# Altium schematic sheet 1U 显示.SchDoc
size A1
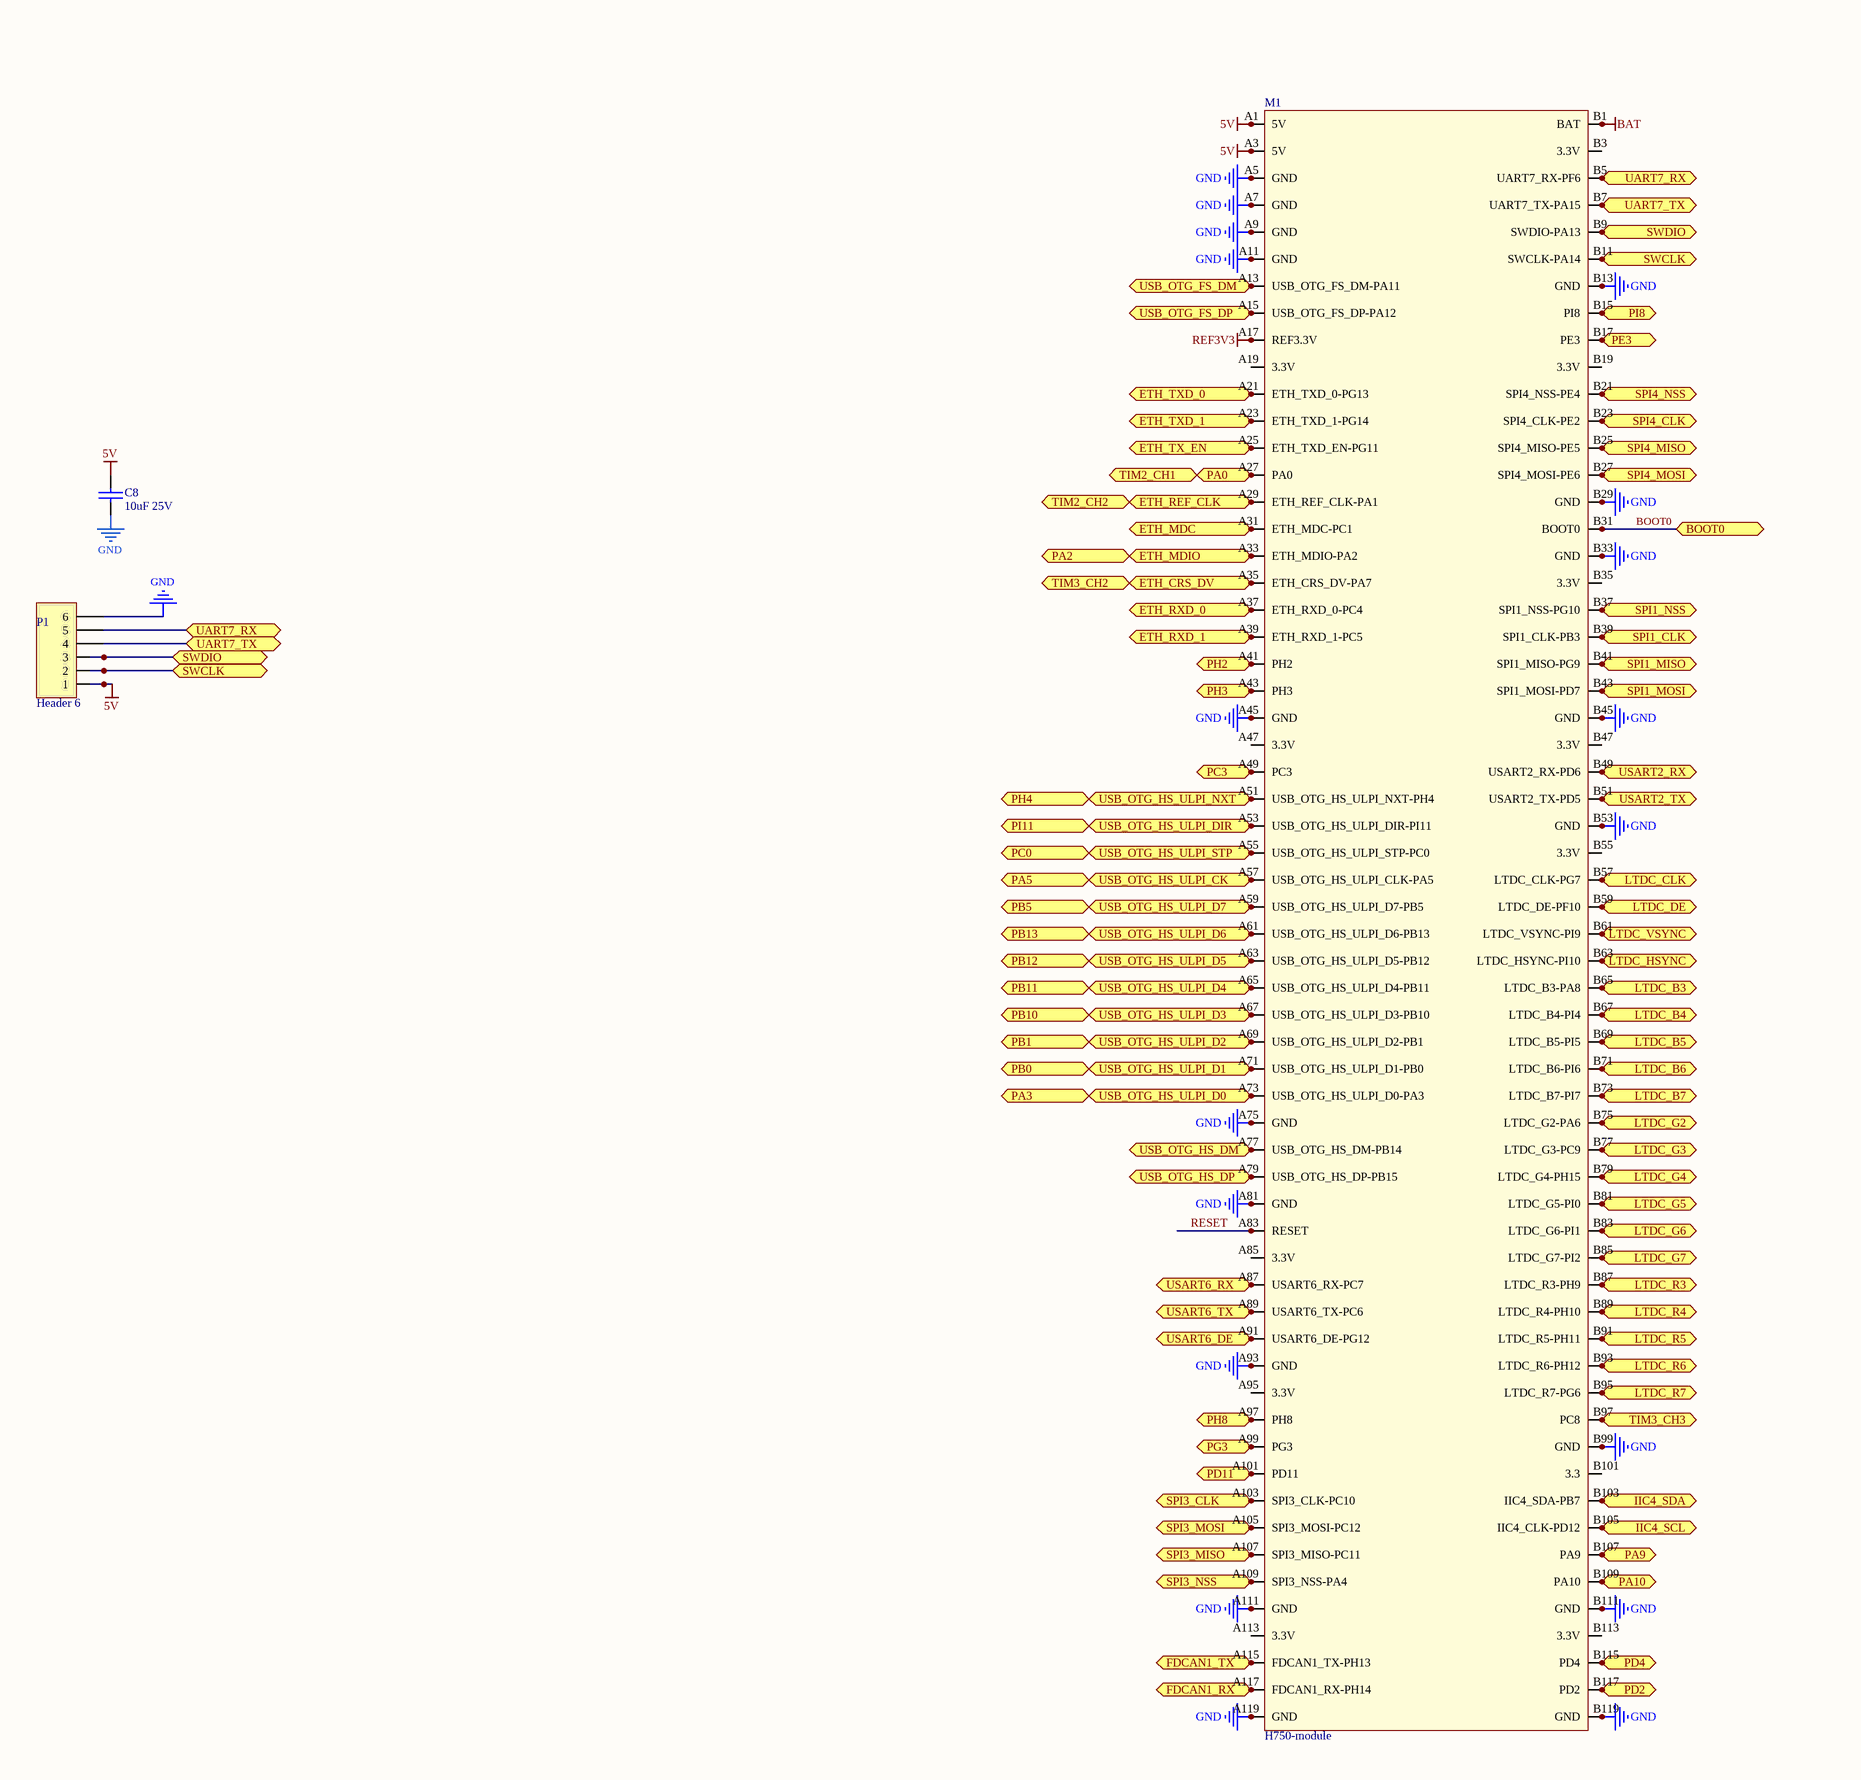
[diagram p0: 1U 显示.SchDoc, left]
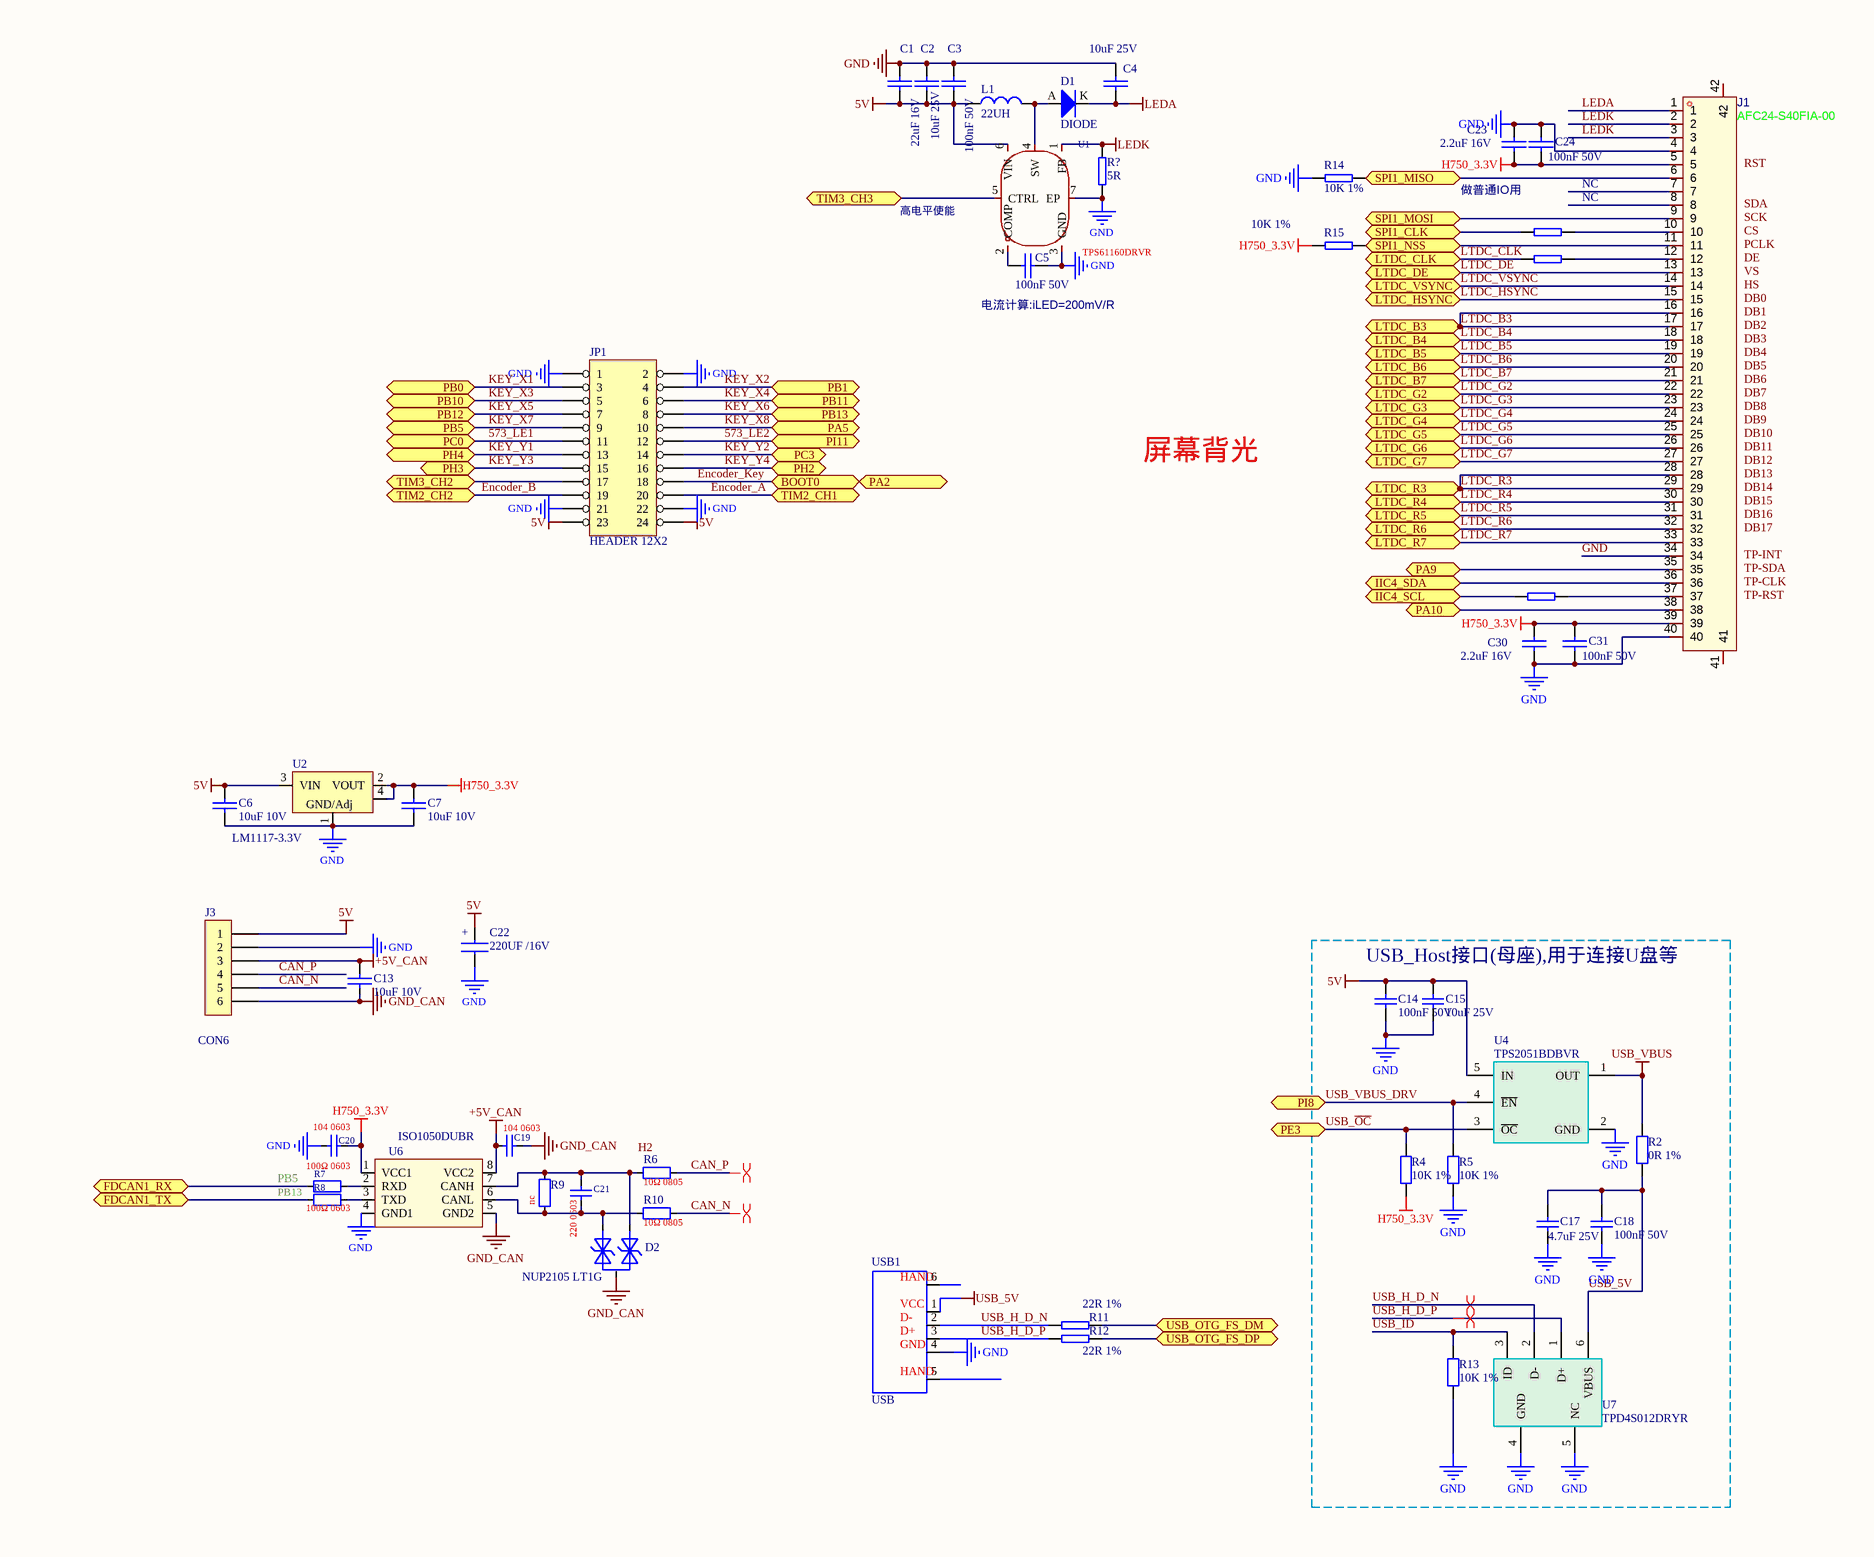
[diagram p1: 1U 显示.SchDoc, right]

## Parts
C1  22uF 16V  [C0805-M]
C2  10uF 25V  [C0805-M]
C3  100nF 50V  [C0805-M]
C4  10uF 25V  [C0805-M]
C5  100nF 50V  [C0603]
C6  10uF 10V  [C0603]
C7  10uF 10V  [C0603]
C8  10uF 25V  [C0805]
C13  10uF 10V  [C0603]
C14  100nF 50V  [C0603]
C15  10uF 25V  [C0805]
C17  4.7uF 25V  [C0603]
C18  100nF 50V  [C0603]
C19  104 0603  [C0603]
C20  104 0603  [C0603]
C21  220 0603  [C0603]
C22  220UF /16V  [RB-.63]
C23  2.2uF 16V  [C0603]
C24  100nF 50V  [C0603]
C30  2.2uF 16V  [C0603]
C31  100nF 50V  [C0603]
D1  DIODE  [SOD-123]
D2  NUP2105 LT1G  [SOT-23]
J1  AFC24-S40FIA-00  [FPC-SMD_P0.50-40P_H2.0]
J3  CON6  [xh-6a]
JP1  HEADER 12X2  [FPC-SMD_P0.50-24P_H2.0]
L1  22UH  [L0520]
M1  H750-module  [H750-module]
P1  Header 6  [HDR1X6]
R2  0R 1%  [R0603]
R4  10K 1%  [R0603]
R5  10K 1%  [R0603]
R6  10Ω 0805  [R0805-M]
R7  100Ω 0603  [R0603]
R8  100Ω 0603  [R0603]
R9  nc  [R0805-M]
R10  10Ω 0805  [R0805-M]
R11  22R 1%  [R0603]
R12  22R 1%  [R0603]
R13  10K 1%  [R0603]
R14  10K 1%  [R0603]
R15  10K 1%  [R0603]
R16  22R 1%  [R0603]  (value not drawn)
R17  22R 1%  [R0603]  (value not drawn)
R18  22R 1%  [R0603]  (value not drawn)
R?  5R  [R0805-M]
U1  TPS61160DRVR  [WSON-6-EP(2x2)]
U2  LM1117-3.3V  [SOT-223]
U4  TPS2051BDBVR  [SOT-23-5]
U6  ISO1050DUBR  [DIP-8/STM]
U7  TPD4S012DRYR  [DRY-6]
USB1  USB  [USB-101]

## Blocks framed on the sheet
USB_Host接口(母座),用于连接U盘等: C14 C15 C17 C18 R2 R4 R5 R13 U4 U7

## Ports
BOOT0 (bidir), ETH_CRS_DV (bidir), ETH_MDC (bidir), ETH_MDIO (bidir), ETH_REF_CLK (bidir), ETH_RXD_0 (bidir), ETH_RXD_1 (bidir), ETH_TX_EN (bidir), ETH_TXD_0 (bidir), ETH_TXD_1 (bidir), FDCAN1_RX (bidir), FDCAN1_TX (bidir), IIC4_SCL (bidir), IIC4_SDA (bidir), LTDC_B3 (bidir), LTDC_B4 (bidir), LTDC_B5 (bidir), LTDC_B6 (bidir), LTDC_B7 (bidir), LTDC_CLK (bidir), LTDC_DE (bidir), LTDC_G2 (bidir), LTDC_G3 (bidir), LTDC_G4 (bidir), LTDC_G5 (bidir), LTDC_G6 (bidir), LTDC_G7 (bidir), LTDC_HSYNC (bidir), LTDC_R3 (bidir), LTDC_R4 (bidir), LTDC_R5 (bidir), LTDC_R6 (bidir), LTDC_R7 (bidir), LTDC_VSYNC (bidir), PA0 (bidir), PA2 (bidir), PA3 (bidir), PA5 (bidir), PA9 (bidir), PA10 (bidir), PB0 (bidir), PB1 (bidir), PB5 (bidir), PB10 (bidir), PB11 (bidir), PB12 (bidir), PB13 (bidir), PC0 (bidir), PC3 (bidir), PD2 (bidir), PD4 (bidir), PD11 (bidir), PE3 (bidir), PG3 (bidir), PH2 (bidir), PH3 (bidir), PH4 (bidir), PH8 (bidir), PI8 (bidir), PI11 (bidir), SPI1_CLK (bidir), SPI1_MISO (bidir), SPI1_MOSI (bidir), SPI1_NSS (bidir), SPI3_CLK (bidir), SPI3_MISO (bidir), SPI3_MOSI (bidir), SPI3_NSS (bidir), SPI4_CLK (bidir), SPI4_MISO (bidir), SPI4_MOSI (bidir), SPI4_NSS (bidir), SWCLK (bidir), SWDIO (bidir), TIM2_CH1 (bidir), TIM2_CH2 (bidir), TIM3_CH2 (bidir), TIM3_CH3 (bidir), UART7_RX (bidir), UART7_TX (bidir), USART2_RX (bidir), USART2_TX (bidir), USART6_DE (bidir), USART6_RX (bidir), USART6_TX (bidir), USB_OTG_FS_DM (bidir), USB_OTG_FS_DP (bidir), USB_OTG_HS_DM (bidir), USB_OTG_HS_DP (bidir), USB_OTG_HS_ULPI_CK (bidir), USB_OTG_HS_ULPI_D0 (bidir), USB_OTG_HS_ULPI_D1 (bidir), USB_OTG_HS_ULPI_D2 (bidir), USB_OTG_HS_ULPI_D3 (bidir), USB_OTG_HS_ULPI_D4 (bidir), USB_OTG_HS_ULPI_D5 (bidir), USB_OTG_HS_ULPI_D6 (bidir), USB_OTG_HS_ULPI_D7 (bidir), USB_OTG_HS_ULPI_DIR (bidir), USB_OTG_HS_ULPI_NXT (bidir), USB_OTG_HS_ULPI_STP (bidir)

## Nets
5V: C1.1 C2.1 C3.1 C6.1 C8.1 C14.2 C15.2 C22.1 J3.1 JP1.23 JP1.24 L1.1 M1.A1(5V) M1.A2 M1.A3(5V) M1.A4 P1.1 U1.6(VIN) U2.3(VIN) U4.5(IN)
+5V_CAN: C13.1 C19.1 J3.3 U6.8(VCC2)
BAT: M1.B1(BAT) M1.B2
GND: C1.2 C2.2 C3.2 C4.2 C5.2 C6.2 C7.2 C8.2 C14.1 C15.1 C17.1 C18.1 C20.1 C22.2 C23.2 C24.1 C30.1 C31.2 J1.4 J1.34 J1.40 J3.2 JP1.1 JP1.2 JP1.21 JP1.22 M1.A5(GND) M1.A6 M1.A7(GND) M1.A8 M1.A9(GND) M1.A10 M1.A11(GND) M1.A12 M1.A45(GND) M1.A46 M1.A75(GND) M1.A76 M1.A81(GND) M1.A82 M1.A93(GND) M1.A94 M1.A111(GND) M1.A112 M1.A119(GND) M1.A120 M1.B13(GND) M1.B14 M1.B29(GND) M1.B30 M1.B33(GND) M1.B34 M1.B45(GND) M1.B46 M1.B53(GND) M1.B54 M1.B99(GND) M1.B100 M1.B111(GND) M1.B112 M1.B119(GND) M1.B120 P1.6 R5.2 R13.2 R14.1 R?.1 U1.3(GND) U1.7(EP) U2.1(GND/Adj) U4.2(GND) U6.4(GND1) U7.4(GND) U7.5(NC) USB1.4
GND_CAN: C13.2 C19.2 D2.3 J3.6 U6.5(GND2)
H750_3.3V: C7.1 C20.2 C23.1 C24.2 C30.2 C31.1 J1.5 J1.39 R4.2 R15.1 U2.2(VOUT) U2.4 U6.1(VCC1)
LEDA: C4.1 D1.K J1.1
LEDK: J1.2 J1.3 R?.2 U1.1(FB)
REF3V3: M1.A17(REF3.3V) M1.A18
USB_5V: C17.2 C18.2 R2.2 U7.6(VBUS) USB1.1
USB_VBUS: R2.1 U4.1(OUT)
573_LE1: JP1.11 M1.A55(USB_OTG_HS_ULPI_STP-PC0) M1.A56 ; port USB_OTG_HS_ULPI_STP, port PC0
573_LE2: JP1.12 M1.A53(USB_OTG_HS_ULPI_DIR-PI11) M1.A54 ; port USB_OTG_HS_ULPI_DIR, port PI11
BOOT0: JP1.18 M1.A33(ETH_MDIO-PA2) M1.A34 M1.B31(BOOT0) M1.B32 ; port ETH_MDIO, port PA2, port BOOT0  [also labelled Encoder_Key]
CAN_N: J3.5 R10.2
CAN_P: J3.4 R6.2
Encoder_A: JP1.20 M1.A27(PA0) M1.A28 ; port PA0, port TIM2_CH1
Encoder_B: JP1.19 M1.A29(ETH_REF_CLK-PA1) M1.A30 ; port ETH_REF_CLK, port TIM2_CH2
ETH_CRS_DV: JP1.17 M1.A35(ETH_CRS_DV-PA7) M1.A36 ; port ETH_CRS_DV, port TIM3_CH2
ETH_MDC: M1.A31(ETH_MDC-PC1) M1.A32 ; port ETH_MDC
ETH_RXD_0: M1.A37(ETH_RXD_0-PC4) M1.A38 ; port ETH_RXD_0
ETH_RXD_1: M1.A39(ETH_RXD_1-PC5) M1.A40 ; port ETH_RXD_1
ETH_TX_EN: M1.A25(ETH_TXD_EN-PG11) M1.A26 ; port ETH_TX_EN
ETH_TXD_0: M1.A21(ETH_TXD_0-PG13) M1.A22 ; port ETH_TXD_0
ETH_TXD_1: M1.A23(ETH_TXD_1-PG14) M1.A24 ; port ETH_TXD_1
IIC4_SCL: M1.B105(IIC4_CLK-PD12) M1.B106 R18.1 ; port IIC4_SCL
IIC4_SDA: J1.36 M1.B103(IIC4_SDA-PB7) M1.B104 ; port IIC4_SDA
KEY_X1: JP1.3 M1.A71(USB_OTG_HS_ULPI_D1-PB0) M1.A72 ; port USB_OTG_HS_ULPI_D1, port PB0
KEY_X2: JP1.4 M1.A69(USB_OTG_HS_ULPI_D2-PB1) M1.A70 ; port USB_OTG_HS_ULPI_D2, port PB1
KEY_X3: JP1.5 M1.A67(USB_OTG_HS_ULPI_D3-PB10) M1.A68 ; port USB_OTG_HS_ULPI_D3, port PB10
KEY_X4: JP1.6 M1.A65(USB_OTG_HS_ULPI_D4-PB11) M1.A66 ; port USB_OTG_HS_ULPI_D4, port PB11
KEY_X5: JP1.7 M1.A63(USB_OTG_HS_ULPI_D5-PB12) M1.A64 ; port USB_OTG_HS_ULPI_D5, port PB12
KEY_X6: JP1.8 M1.A61(USB_OTG_HS_ULPI_D6-PB13) M1.A62 ; port USB_OTG_HS_ULPI_D6, port PB13
KEY_X7: JP1.9 M1.A59(USB_OTG_HS_ULPI_D7-PB5) M1.A60 ; port USB_OTG_HS_ULPI_D7, port PB5
KEY_X8: JP1.10 M1.A57(USB_OTG_HS_ULPI_CLK-PA5) M1.A58 ; port USB_OTG_HS_ULPI_CK, port PA5
KEY_Y1: JP1.13 M1.A51(USB_OTG_HS_ULPI_NXT-PH4) M1.A52 ; port USB_OTG_HS_ULPI_NXT, port PH4
KEY_Y2: JP1.14 M1.A49(PC3) M1.A50 ; port PC3
KEY_Y3: JP1.15 M1.A43(PH3) M1.A44 ; port PH3
KEY_Y4: JP1.16 M1.A41(PH2) M1.A42 ; port PH2
LTDC_B3: J1.16 J1.17 M1.B65(LTDC_B3-PA8) M1.B66 ; port LTDC_B3
LTDC_B4: J1.18 M1.B67(LTDC_B4-PI4) M1.B68 ; port LTDC_B4
LTDC_B5: J1.19 M1.B69(LTDC_B5-PI5) M1.B70 ; port LTDC_B5
LTDC_B6: J1.20 M1.B71(LTDC_B6-PI6) M1.B72 ; port LTDC_B6
LTDC_B7: J1.21 M1.B73(LTDC_B7-PI7) M1.B74 ; port LTDC_B7
LTDC_CLK: M1.B57(LTDC_CLK-PG7) M1.B58 R17.1 ; port LTDC_CLK
LTDC_DE: J1.13 M1.B59(LTDC_DE-PF10) M1.B60 ; port LTDC_DE
LTDC_G2: J1.22 M1.B75(LTDC_G2-PA6) M1.B76 ; port LTDC_G2
LTDC_G3: J1.23 M1.B77(LTDC_G3-PC9) M1.B78 ; port LTDC_G3
LTDC_G4: J1.24 M1.B79(LTDC_G4-PH15) M1.B80 ; port LTDC_G4
LTDC_G5: J1.25 M1.B81(LTDC_G5-PI0) M1.B82 ; port LTDC_G5
LTDC_G6: J1.26 M1.B83(LTDC_G6-PI1) M1.B84 ; port LTDC_G6
LTDC_G7: J1.27 M1.B85(LTDC_G7-PI2) M1.B86 ; port LTDC_G7
LTDC_HSYNC: J1.15 M1.B63(LTDC_HSYNC-PI10) M1.B64 ; port LTDC_HSYNC
LTDC_R3: J1.28 J1.29 M1.B87(LTDC_R3-PH9) M1.B88 ; port LTDC_R3
LTDC_R4: J1.30 M1.B89(LTDC_R4-PH10) M1.B90 ; port LTDC_R4
LTDC_R5: J1.31 M1.B91(LTDC_R5-PH11) M1.B92 ; port LTDC_R5
LTDC_R6: J1.32 M1.B93(LTDC_R6-PH12) M1.B94 ; port LTDC_R6
LTDC_R7: J1.33 M1.B95(LTDC_R7-PG6) M1.B96 ; port LTDC_R7
LTDC_VSYNC: J1.14 M1.B61(LTDC_VSYNC-PI9) M1.B62 ; port LTDC_VSYNC
PA3: M1.A73(USB_OTG_HS_ULPI_D0-PA3) M1.A74 ; port USB_OTG_HS_ULPI_D0, port PA3
PA9: J1.35 M1.B107(PA9) M1.B108 ; port PA9
PA10: J1.38 M1.B109(PA10) M1.B110 ; port PA10
PB5: M1.A117(FDCAN1_RX-PH14) M1.A118 R7.2 ; port FDCAN1_RX
PB13: M1.A115(FDCAN1_TX-PH13) M1.A116 R8.2 ; port FDCAN1_TX
PD2: M1.B117(PD2) M1.B118 ; port PD2
PD4: M1.B115(PD4) M1.B116 ; port PD4
PD11: M1.A101(PD11) M1.A102 ; port PD11
PG3: M1.A99(PG3) M1.A100 ; port PG3
PH8: M1.A97(PH8) M1.A98 ; port PH8
RESET: M1.A83(RESET) M1.A84
SPI1_CLK: M1.B39(SPI1_CLK-PB3) M1.B40 R16.1 ; port SPI1_CLK
SPI1_MISO: J1.6 M1.B41(SPI1_MISO-PG9) M1.B42 R14.2 ; port SPI1_MISO
SPI1_MOSI: J1.9 M1.B43(SPI1_MOSI-PD7) M1.B44 ; port SPI1_MOSI
SPI1_NSS: J1.11 M1.B37(SPI1_NSS-PG10) M1.B38 R15.2 ; port SPI1_NSS
SPI3_CLK: M1.A103(SPI3_CLK-PC10) M1.A104 ; port SPI3_CLK
SPI3_MISO: M1.A107(SPI3_MISO-PC11) M1.A108 ; port SPI3_MISO
SPI3_MOSI: M1.A105(SPI3_MOSI-PC12) M1.A106 ; port SPI3_MOSI
SPI3_NSS: M1.A109(SPI3_NSS-PA4) M1.A110 ; port SPI3_NSS
SPI4_CLK: M1.B23(SPI4_CLK-PE2) M1.B24 ; port SPI4_CLK
SPI4_MISO: M1.B25(SPI4_MISO-PE5) M1.B26 ; port SPI4_MISO
SPI4_MOSI: M1.B27(SPI4_MOSI-PE6) M1.B28 ; port SPI4_MOSI
SPI4_NSS: M1.B21(SPI4_NSS-PE4) M1.B22 ; port SPI4_NSS
SWCLK: M1.B11(SWCLK-PA14) M1.B12 P1.2 ; port SWCLK
SWDIO: M1.B9(SWDIO-PA13) M1.B10 P1.3 ; port SWDIO
TIM3_CH3: M1.B97(PC8) M1.B98 U1.5(CTRL) ; port TIM3_CH3
UART7_RX: M1.B5(UART7_RX-PF6) M1.B6 P1.5 ; port UART7_RX
UART7_TX: M1.B7(UART7_TX-PA15) M1.B8 P1.4 ; port UART7_TX
USART2_RX: M1.B49(USART2_RX-PD6) M1.B50 ; port USART2_RX
USART2_TX: M1.B51(USART2_TX-PD5) M1.B52 ; port USART2_TX
USART6_DE: M1.A91(USART6_DE-PG12) M1.A92 ; port USART6_DE
USART6_RX: M1.A87(USART6_RX-PC7) M1.A88 ; port USART6_RX
USART6_TX: M1.A89(USART6_TX-PC6) M1.A90 ; port USART6_TX
USB_H_D_N: R11.1 U7.2(D-) USB1.2
USB_H_D_P: R12.1 U7.1(D+) USB1.3
USB_ID: R13.1 U7.3(ID)
USB_~{OC}: M1.B17(PE3) M1.B18 R4.1 U4.3(~{OC}) ; port PE3
USB_OTG_FS_DM: M1.A13(USB_OTG_FS_DM-PA11) M1.A14 R11.2 ; port USB_OTG_FS_DM
USB_OTG_FS_DP: M1.A15(USB_OTG_FS_DP-PA12) M1.A16 R12.2 ; port USB_OTG_FS_DP
USB_OTG_HS_DM: M1.A77(USB_OTG_HS_DM-PB14) M1.A78 ; port USB_OTG_HS_DM
USB_OTG_HS_DP: M1.A79(USB_OTG_HS_DP-PB15) M1.A80 ; port USB_OTG_HS_DP
USB_VBUS_DRV: M1.B15(PI8) M1.B16 R5.1 U4.4(~{EN}) ; port PI8
NetC5_1: C5.1 U1.2(COMP)
NetC21_1: C21.1 D2.2 R9.2 R10.1 U6.6(CANL)
NetC21_2: C21.2 D2.1 R6.1 R9.1 U6.7(CANH)
NetD1_A: D1.A L1.2 U1.4(SW)
NetJ1_10: J1.10 R16.2
NetJ1_12: J1.12 R17.2
NetJ1_37: J1.37 R18.2
NetM1_A19: M1.A19(3.3V) M1.A20
NetM1_A47: M1.A47(3.3V) M1.A48
NetM1_A85: M1.A85(3.3V) M1.A86
NetM1_A95: M1.A95(3.3V) M1.A96
NetM1_A113: M1.A113(3.3V) M1.A114
NetM1_B3: M1.B3(3.3V) M1.B4
NetM1_B19: M1.B19(3.3V) M1.B20
NetM1_B35: M1.B35(3.3V) M1.B36
NetM1_B47: M1.B47(3.3V) M1.B48
NetM1_B55: M1.B55(3.3V) M1.B56
NetM1_B101: M1.B101(3.3) M1.B102
NetM1_B113: M1.B113(3.3V) M1.B114
NetR7_1: R7.1 U6.2(RXD)
NetR8_1: R8.1 U6.3(TXD)

Not connected (* = marked no-connect by the designer): J1 7 8 41 42; USB1 5 6

## Layout directives
differential pair; net class USB1: USB_H_D_N, USB_H_D_P
differential pair; net class CAN: CAN_N, CAN_P

## Notes on the sheet
- 做普通IO用
- NC
- (near R16) NC
- 高电平使能
- 电流计算:iLED=200mV/R
- 屏幕背光
- Labels drawn without touching a wire or pin: CS, DB0, DB1, DB2, DB3, DB4, DB5, DB6, DB7, DB8, DB9, DB10, DB11, DB12, DB13, DB14, DB15, DB16, DB17, DE, H2, HS, PCLK, RST, SCK, SDA, TP-CLK, TP-INT, TP-RST, TP-SDA, VS
- (in symbol ELECTR) +
- (in symbol USB) HAND; VCC; D-; D+; GND

## Library data of the parts
C1 = 22uF 0805 16V: 贴片电容; Type: 22uF ±20% 16V; LCSC: C116973
C2 C4 C8 = 10uF 0805 25V: 贴片电容; Type: 10uF (106) ±10% 25V X5R; LCSC: C15850
C3 = 100nF 0805 50V: 贴片电容; Type: 100nF(104) ±10% 50V X7R; LCSC: C49678
C5 C24 C31 = 100nF 0603 50V: 贴片电容; Type: 100nF (104) ±10% 50V X7R; LCSC: C14663
C6 C7 C13 = 10uF 0603 10V: 贴片电容; Type: 10uF (106) ±10% 10V X5R; LCSC: C19702
C14 C15 C17 C18 = Cap: 电容; Co.Number: .................
C19-C21 = C_0603: 无极性贴片电容_0603
C22 = ELECTR: UNIT: 110101700510X; UNIT-TYPE: (CD)贴片电解电容Chip Cap 220uF 士20%/16V，Φ6.3×7.7(RoHS)
C23 C30 = 2.2uF 0603 16V: 贴片电容; Type: 2.2uF   ±10% 16V X5R; LCSC: C23630
D2 = NUP2105 SOT-23: CAN ESD; Type: NUP2105LT1G，SOT-23，ON
J1 = AFC24-S40FIA-00: FPC 40PIN 0.5mm; Symbol: AFC24-S40FIA-00
J3 = CON6: Connector
L1 = INDUCTOR
M1 = H750-module: H750核心板
P1 = Header 6: Header, 6-Pin; LatestRevisionDate: 17-Jul-2002; LatestRevisionNote: Re-released for DXP Platform.; Publisher: Altium Limited
R2 R4 R5 R13 = Res2: Resistor; Published: *; LatestRevisionDate: *; LatestRevisionNote: *; PackageReference: *; Publisher: *; Value: *
R6-R10 = R_0603: 贴片电阻_0603封装
R11 R12 R16-R18 = 22R 1% 0603: 贴片电阻; Type: 22R ±1% 0603; LCSC: C23345
R14 R15 = 10K 1% 0603: 贴片电阻; Type: 10K ±1% 0603; LCSC: C25804
R? = RES
U1 = TPS61160DRVR: LCD 背光驱动; Manufacturer: TI(德州仪器); Add into BOM: yes; Input Voltage: 2.7V~18V; Switch Frequency: 600kHz; Channels: 1; Output Voltage: 26V; Output Current: 700mA; Dimming: PWM; Topology: 升压; Symbol: TPS61160DRVR; Device: TPS61160DRVR; LCSC Part Name: TPS61160DRVR; Supplier Part: C165143; Manufacturer Part: TPS61160DRVR; Supplier Footprint: WSON-6-EP(2x2); JLCPCB Part Class: 扩展库; Datasheet: https://www.ti.com/cn/lit/gpn/tps61160; Supplier: LCSC; Convert to PCB: yes; Type: DC-DC稳压器; Operating temperature: -40℃~+85℃
U2 = LM1117-3.3V SOT-223: 线性稳压; Type: LM1117-3.3V，SOT-223，3.3V; LCSC: C6186
U4 = TPS2051BDBVR: UNIT: 110100200895X; UNIT_TYPE: (CD)IC/贴片/USB限流配电开关/TPS2051BDBVR/SOT-23/TI
U7 = TPD4S012: USB OTG ESD保护; UNIT: 110100200883X; UNIT-TYPE: (CD)IC USB ESD保护芯片 TPD4S012DRYR SON-6 "TI"牌(RoHS)
U6 = ISO1050DUBR: TYPE: ISO1050DUBR ,SOP-8DUB,TI